# Altium schematic sheet POV_LED_SOLID.SchDoc
size A2
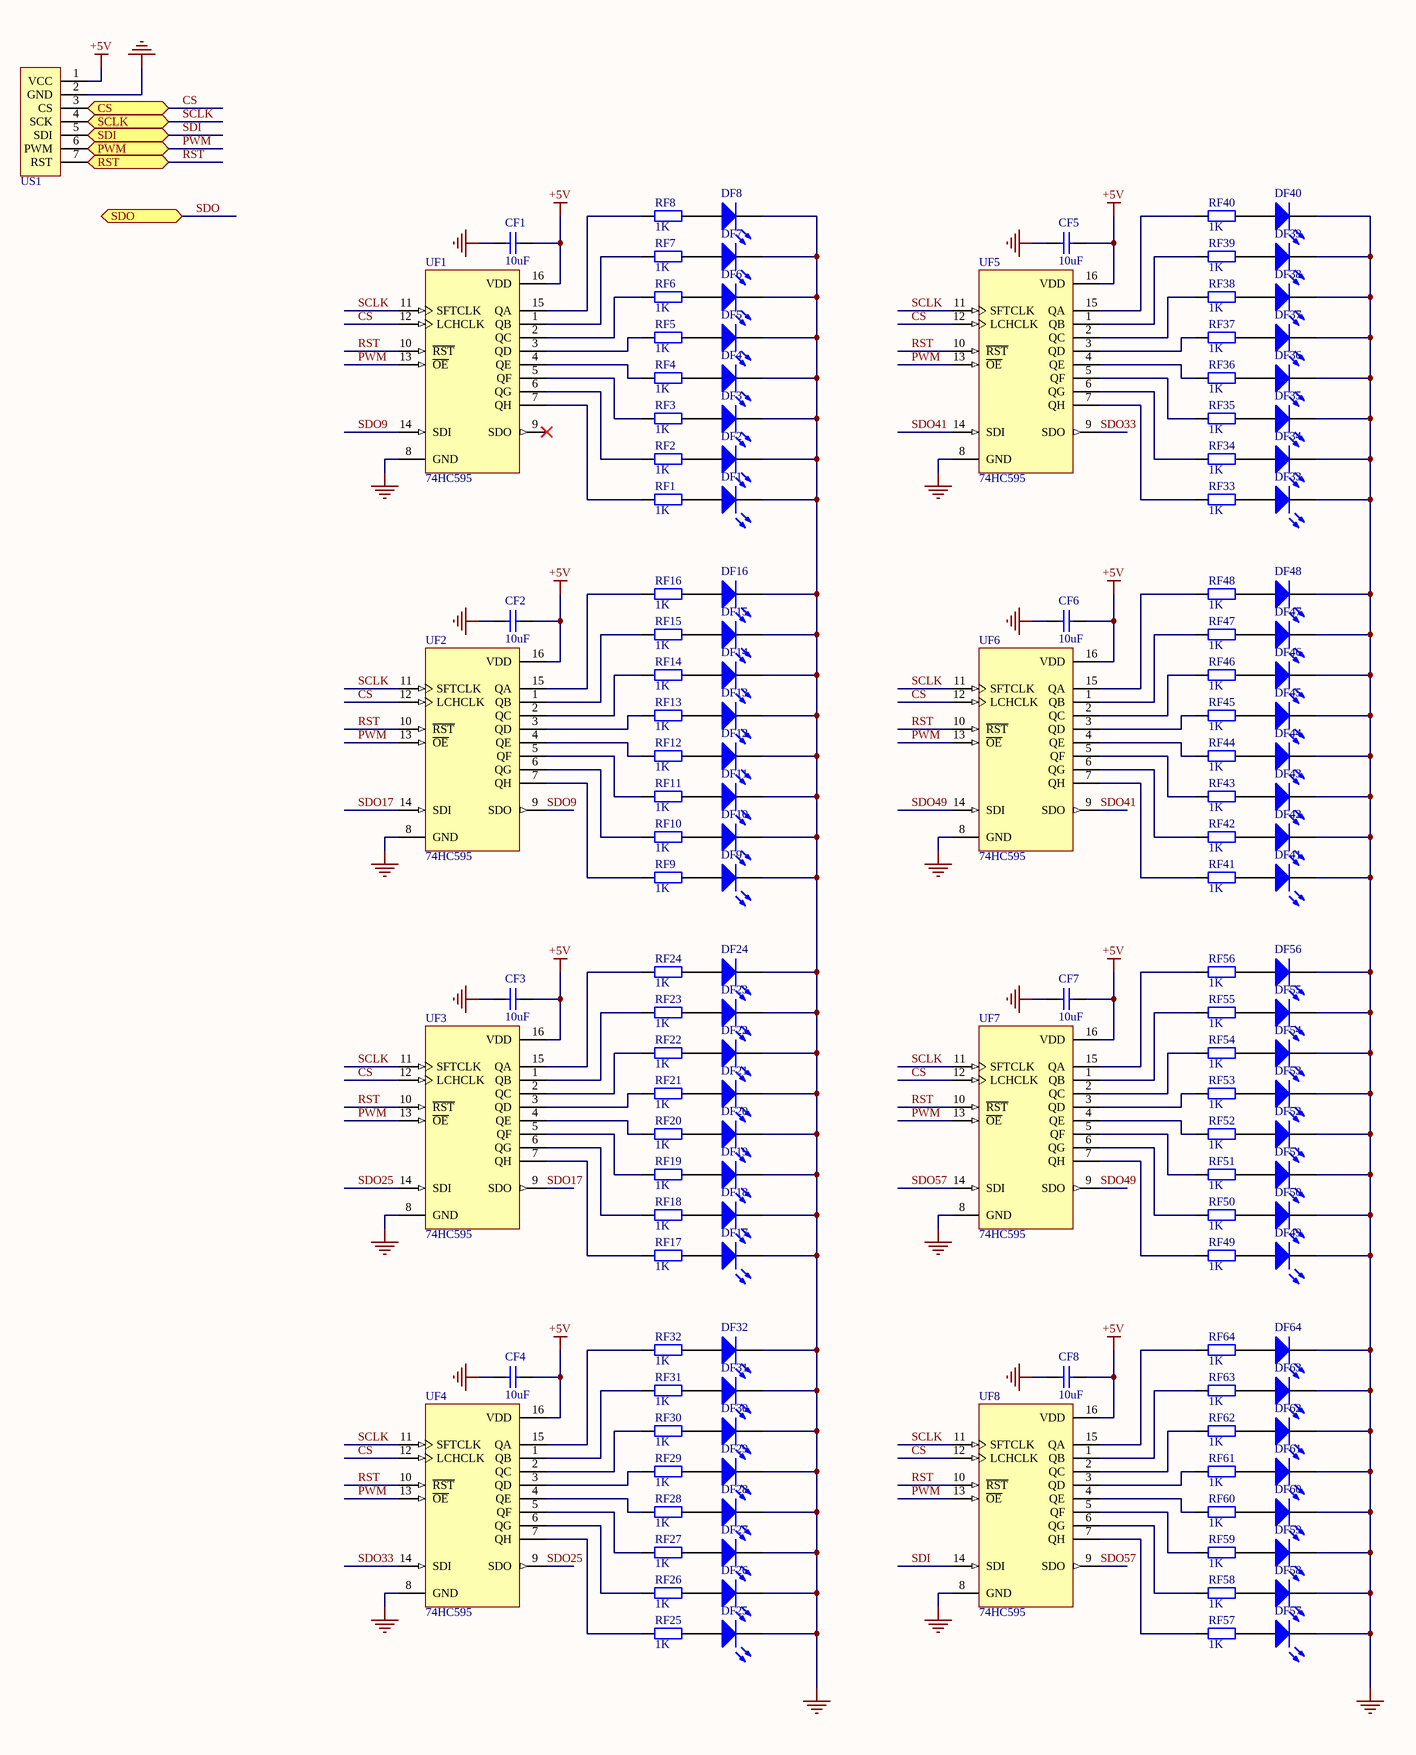
[diagram p0: POV_LED_SOLID.SchDoc]

## Parts
CF1  value 10uF  [CAPC1608N]  (hidden comment: Cap1)
CF2  value 10uF  [CAPC1608N]  (hidden comment: Cap1)
CF3  value 10uF  [CAPC1608N]  (hidden comment: Cap1)
CF4  value 10uF  [CAPC1608N]  (hidden comment: Cap1)
CF5  value 10uF  [CAPC1608N]  (hidden comment: Cap1)
CF6  value 10uF  [CAPC1608N]  (hidden comment: Cap1)
CF7  value 10uF  [CAPC1608N]  (hidden comment: Cap1)
CF8  value 10uF  [CAPC1608N]  (hidden comment: Cap1)
DF1  (no value)  [CD1005-0402-L]
DF2  (no value)  [CD1005-0402-L]
DF3  (no value)  [CD1005-0402-L]
DF4  (no value)  [CD1005-0402-L]
DF5  (no value)  [CD1005-0402-L]
DF6  (no value)  [CD1005-0402-L]
DF7  (no value)  [CD1005-0402-L]
DF8  (no value)  [CD1005-0402-L]
DF9  (no value)  [CD1005-0402-L]
DF10  (no value)  [CD1005-0402-L]
DF11  (no value)  [CD1005-0402-L]
DF12  (no value)  [CD1005-0402-L]
DF13  (no value)  [CD1005-0402-L]
DF14  (no value)  [CD1005-0402-L]
DF15  (no value)  [CD1005-0402-L]
DF16  (no value)  [CD1005-0402-L]
DF17  (no value)  [CD1005-0402-L]
DF18  (no value)  [CD1005-0402-L]
DF19  (no value)  [CD1005-0402-L]
DF20  (no value)  [CD1005-0402-L]
DF21  (no value)  [CD1005-0402-L]
DF22  (no value)  [CD1005-0402-L]
DF23  (no value)  [CD1005-0402-L]
DF24  (no value)  [CD1005-0402-L]
DF25  (no value)  [CD1005-0402-L]
DF26  (no value)  [CD1005-0402-L]
DF27  (no value)  [CD1005-0402-L]
DF28  (no value)  [CD1005-0402-L]
DF29  (no value)  [CD1005-0402-L]
DF30  (no value)  [CD1005-0402-L]
DF31  (no value)  [CD1005-0402-L]
DF32  (no value)  [CD1005-0402-L]
DF33  (no value)  [CD1005-0402-L]
DF34  (no value)  [CD1005-0402-L]
DF35  (no value)  [CD1005-0402-L]
DF36  (no value)  [CD1005-0402-L]
DF37  (no value)  [CD1005-0402-L]
DF38  (no value)  [CD1005-0402-L]
DF39  (no value)  [CD1005-0402-L]
DF40  (no value)  [CD1005-0402-L]
DF41  (no value)  [CD1005-0402-L]
DF42  (no value)  [CD1005-0402-L]
DF43  (no value)  [CD1005-0402-L]
DF44  (no value)  [CD1005-0402-L]
DF45  (no value)  [CD1005-0402-L]
DF46  (no value)  [CD1005-0402-L]
DF47  (no value)  [CD1005-0402-L]
DF48  (no value)  [CD1005-0402-L]
DF49  (no value)  [CD1005-0402-L]
DF50  (no value)  [CD1005-0402-L]
DF51  (no value)  [CD1005-0402-L]
DF52  (no value)  [CD1005-0402-L]
DF53  (no value)  [CD1005-0402-L]
DF54  (no value)  [CD1005-0402-L]
DF55  (no value)  [CD1005-0402-L]
DF56  (no value)  [CD1005-0402-L]
DF57  (no value)  [CD1005-0402-L]
DF58  (no value)  [CD1005-0402-L]
DF59  (no value)  [CD1005-0402-L]
DF60  (no value)  [CD1005-0402-L]
DF61  (no value)  [CD1005-0402-L]
DF62  (no value)  [CD1005-0402-L]
DF63  (no value)  [CD1005-0402-L]
DF64  (no value)  [CD1005-0402-L]
RF1  value 1K  [RESC1005L-0.5]  (hidden comment: Res1)
RF2  value 1K  [RESC1005L-0.5]  (hidden comment: Res1)
RF3  value 1K  [RESC1005L-0.5]  (hidden comment: Res1)
RF4  value 1K  [RESC1005L-0.5]  (hidden comment: Res1)
RF5  value 1K  [RESC1005L-0.5]  (hidden comment: Res1)
RF6  value 1K  [RESC1005L-0.5]  (hidden comment: Res1)
RF7  value 1K  [RESC1005L-0.5]  (hidden comment: Res1)
RF8  value 1K  [RESC1005L-0.5]  (hidden comment: Res1)
RF9  value 1K  [RESC1005L-0.5]  (hidden comment: Res1)
RF10  value 1K  [RESC1005L-0.5]  (hidden comment: Res1)
RF11  value 1K  [RESC1005L-0.5]  (hidden comment: Res1)
RF12  value 1K  [RESC1005L-0.5]  (hidden comment: Res1)
RF13  value 1K  [RESC1005L-0.5]  (hidden comment: Res1)
RF14  value 1K  [RESC1005L-0.5]  (hidden comment: Res1)
RF15  value 1K  [RESC1005L-0.5]  (hidden comment: Res1)
RF16  value 1K  [RESC1005L-0.5]  (hidden comment: Res1)
RF17  value 1K  [RESC1005L-0.5]  (hidden comment: Res1)
RF18  value 1K  [RESC1005L-0.5]  (hidden comment: Res1)
RF19  value 1K  [RESC1005L-0.5]  (hidden comment: Res1)
RF20  value 1K  [RESC1005L-0.5]  (hidden comment: Res1)
RF21  value 1K  [RESC1005L-0.5]  (hidden comment: Res1)
RF22  value 1K  [RESC1005L-0.5]  (hidden comment: Res1)
RF23  value 1K  [RESC1005L-0.5]  (hidden comment: Res1)
RF24  value 1K  [RESC1005L-0.5]  (hidden comment: Res1)
RF25  value 1K  [RESC1005L-0.5]  (hidden comment: Res1)
RF26  value 1K  [RESC1005L-0.5]  (hidden comment: Res1)
RF27  value 1K  [RESC1005L-0.5]  (hidden comment: Res1)
RF28  value 1K  [RESC1005L-0.5]  (hidden comment: Res1)
RF29  value 1K  [RESC1005L-0.5]  (hidden comment: Res1)
RF30  value 1K  [RESC1005L-0.5]  (hidden comment: Res1)
RF31  value 1K  [RESC1005L-0.5]  (hidden comment: Res1)
RF32  value 1K  [RESC1005L-0.5]  (hidden comment: Res1)
RF33  value 1K  [RESC1005L-0.5]  (hidden comment: Res1)
RF34  value 1K  [RESC1005L-0.5]  (hidden comment: Res1)
RF35  value 1K  [RESC1005L-0.5]  (hidden comment: Res1)
RF36  value 1K  [RESC1005L-0.5]  (hidden comment: Res1)
RF37  value 1K  [RESC1005L-0.5]  (hidden comment: Res1)
RF38  value 1K  [RESC1005L-0.5]  (hidden comment: Res1)
RF39  value 1K  [RESC1005L-0.5]  (hidden comment: Res1)
RF40  value 1K  [RESC1005L-0.5]  (hidden comment: Res1)
RF41  value 1K  [RESC1005L-0.5]  (hidden comment: Res1)
RF42  value 1K  [RESC1005L-0.5]  (hidden comment: Res1)
RF43  value 1K  [RESC1005L-0.5]  (hidden comment: Res1)
RF44  value 1K  [RESC1005L-0.5]  (hidden comment: Res1)
RF45  value 1K  [RESC1005L-0.5]  (hidden comment: Res1)
RF46  value 1K  [RESC1005L-0.5]  (hidden comment: Res1)
RF47  value 1K  [RESC1005L-0.5]  (hidden comment: Res1)
RF48  value 1K  [RESC1005L-0.5]  (hidden comment: Res1)
RF49  value 1K  [RESC1005L-0.5]  (hidden comment: Res1)
RF50  value 1K  [RESC1005L-0.5]  (hidden comment: Res1)
RF51  value 1K  [RESC1005L-0.5]  (hidden comment: Res1)
RF52  value 1K  [RESC1005L-0.5]  (hidden comment: Res1)
RF53  value 1K  [RESC1005L-0.5]  (hidden comment: Res1)
RF54  value 1K  [RESC1005L-0.5]  (hidden comment: Res1)
RF55  value 1K  [RESC1005L-0.5]  (hidden comment: Res1)
RF56  value 1K  [RESC1005L-0.5]  (hidden comment: Res1)
RF57  value 1K  [RESC1005L-0.5]  (hidden comment: Res1)
RF58  value 1K  [RESC1005L-0.5]  (hidden comment: Res1)
RF59  value 1K  [RESC1005L-0.5]  (hidden comment: Res1)
RF60  value 1K  [RESC1005L-0.5]  (hidden comment: Res1)
RF61  value 1K  [RESC1005L-0.5]  (hidden comment: Res1)
RF62  value 1K  [RESC1005L-0.5]  (hidden comment: Res1)
RF63  value 1K  [RESC1005L-0.5]  (hidden comment: Res1)
RF64  value 1K  [RESC1005L-0.5]  (hidden comment: Res1)
UF1  74HC595  [TSSOP-16N]
UF2  74HC595  [TSSOP-16N]
UF3  74HC595  [TSSOP-16N]
UF4  74HC595  [TSSOP-16N]
UF5  74HC595  [TSSOP-16N]
UF6  74HC595  [TSSOP-16N]
UF7  74HC595  [TSSOP-16N]
UF8  74HC595  [TSSOP-16N]
US1  SOLID_LED2  [SOLID_LED2]  (value not drawn)

## Ports
CS, PWM, RST, SCLK, SDI, SDO

## Nets
+5V: CF1.2 CF2.2 CF3.2 CF4.2 CF5.2 CF6.2 CF7.2 CF8.2 UF1.16(VDD) UF2.16(VDD) UF3.16(VDD) UF4.16(VDD) UF5.16(VDD) UF6.16(VDD) UF7.16(VDD) UF8.16(VDD) US1.1(VCC)
GND: CF1.1 CF2.1 CF3.1 CF4.1 CF5.1 CF6.1 CF7.1 CF8.1 DF1.2(K) DF2.2(K) DF3.2(K) DF4.2(K) DF5.2(K) DF6.2(K) DF7.2(K) DF8.2(K) DF9.2(K) DF10.2(K) DF11.2(K) DF12.2(K) DF13.2(K) DF14.2(K) DF15.2(K) DF16.2(K) DF17.2(K) DF18.2(K) DF19.2(K) DF20.2(K) DF21.2(K) DF22.2(K) DF23.2(K) DF24.2(K) DF25.2(K) DF26.2(K) DF27.2(K) DF28.2(K) DF29.2(K) DF30.2(K) DF31.2(K) DF32.2(K) DF33.2(K) DF34.2(K) DF35.2(K) DF36.2(K) DF37.2(K) DF38.2(K) DF39.2(K) DF40.2(K) DF41.2(K) DF42.2(K) DF43.2(K) DF44.2(K) DF45.2(K) DF46.2(K) DF47.2(K) DF48.2(K) DF49.2(K) DF50.2(K) DF51.2(K) DF52.2(K) DF53.2(K) DF54.2(K) DF55.2(K) DF56.2(K) DF57.2(K) DF58.2(K) DF59.2(K) DF60.2(K) DF61.2(K) DF62.2(K) DF63.2(K) DF64.2(K) UF1.8(GND) UF2.8(GND) UF3.8(GND) UF4.8(GND) UF5.8(GND) UF6.8(GND) UF7.8(GND) UF8.8(GND) US1.2(GND)
CS: UF1.12(LCHCLK) UF2.12(LCHCLK) UF3.12(LCHCLK) UF4.12(LCHCLK) UF5.12(LCHCLK) UF6.12(LCHCLK) UF7.12(LCHCLK) UF8.12(LCHCLK) US1.3(CS) ; port CS
PWM: UF1.13(~{OE}) UF2.13(~{OE}) UF3.13(~{OE}) UF4.13(~{OE}) UF5.13(~{OE}) UF6.13(~{OE}) UF7.13(~{OE}) UF8.13(~{OE}) US1.6(PWM) ; port PWM
RST: UF1.10(~{RST}) UF2.10(~{RST}) UF3.10(~{RST}) UF4.10(~{RST}) UF5.10(~{RST}) UF6.10(~{RST}) UF7.10(~{RST}) UF8.10(~{RST}) US1.7(RST) ; port RST
SCLK: UF1.11(SFTCLK) UF2.11(SFTCLK) UF3.11(SFTCLK) UF4.11(SFTCLK) UF5.11(SFTCLK) UF6.11(SFTCLK) UF7.11(SFTCLK) UF8.11(SFTCLK) US1.4(SCK) ; port SCLK
SDI: UF8.14(SDI) US1.5(SDI) ; port SDI
SDO: port SDO
SDO9: UF1.14(SDI) UF2.9(SDO)
SDO17: UF2.14(SDI) UF3.9(SDO)
SDO25: UF3.14(SDI) UF4.9(SDO)
SDO33: UF4.14(SDI) UF5.9(SDO)
SDO41: UF5.14(SDI) UF6.9(SDO)
SDO49: UF6.14(SDI) UF7.9(SDO)
SDO57: UF7.14(SDI) UF8.9(SDO)
NetDF1_1: DF1.1(A) RF1.2
NetDF2_1: DF2.1(A) RF2.2
NetDF3_1: DF3.1(A) RF3.2
NetDF4_1: DF4.1(A) RF4.2
NetDF5_1: DF5.1(A) RF5.2
NetDF6_1: DF6.1(A) RF6.2
NetDF7_1: DF7.1(A) RF7.2
NetDF8_1: DF8.1(A) RF8.2
NetDF9_1: DF9.1(A) RF9.2
NetDF10_1: DF10.1(A) RF10.2
NetDF11_1: DF11.1(A) RF11.2
NetDF12_1: DF12.1(A) RF12.2
NetDF13_1: DF13.1(A) RF13.2
NetDF14_1: DF14.1(A) RF14.2
NetDF15_1: DF15.1(A) RF15.2
NetDF16_1: DF16.1(A) RF16.2
NetDF17_1: DF17.1(A) RF17.2
NetDF18_1: DF18.1(A) RF18.2
NetDF19_1: DF19.1(A) RF19.2
NetDF20_1: DF20.1(A) RF20.2
NetDF21_1: DF21.1(A) RF21.2
NetDF22_1: DF22.1(A) RF22.2
NetDF23_1: DF23.1(A) RF23.2
NetDF24_1: DF24.1(A) RF24.2
NetDF25_1: DF25.1(A) RF25.2
NetDF26_1: DF26.1(A) RF26.2
NetDF27_1: DF27.1(A) RF27.2
NetDF28_1: DF28.1(A) RF28.2
NetDF29_1: DF29.1(A) RF29.2
NetDF30_1: DF30.1(A) RF30.2
NetDF31_1: DF31.1(A) RF31.2
NetDF32_1: DF32.1(A) RF32.2
NetDF33_1: DF33.1(A) RF33.2
NetDF34_1: DF34.1(A) RF34.2
NetDF35_1: DF35.1(A) RF35.2
NetDF36_1: DF36.1(A) RF36.2
NetDF37_1: DF37.1(A) RF37.2
NetDF38_1: DF38.1(A) RF38.2
NetDF39_1: DF39.1(A) RF39.2
NetDF40_1: DF40.1(A) RF40.2
NetDF41_1: DF41.1(A) RF41.2
NetDF42_1: DF42.1(A) RF42.2
NetDF43_1: DF43.1(A) RF43.2
NetDF44_1: DF44.1(A) RF44.2
NetDF45_1: DF45.1(A) RF45.2
NetDF46_1: DF46.1(A) RF46.2
NetDF47_1: DF47.1(A) RF47.2
NetDF48_1: DF48.1(A) RF48.2
NetDF49_1: DF49.1(A) RF49.2
NetDF50_1: DF50.1(A) RF50.2
NetDF51_1: DF51.1(A) RF51.2
NetDF52_1: DF52.1(A) RF52.2
NetDF53_1: DF53.1(A) RF53.2
NetDF54_1: DF54.1(A) RF54.2
NetDF55_1: DF55.1(A) RF55.2
NetDF56_1: DF56.1(A) RF56.2
NetDF57_1: DF57.1(A) RF57.2
NetDF58_1: DF58.1(A) RF58.2
NetDF59_1: DF59.1(A) RF59.2
NetDF60_1: DF60.1(A) RF60.2
NetDF61_1: DF61.1(A) RF61.2
NetDF62_1: DF62.1(A) RF62.2
NetDF63_1: DF63.1(A) RF63.2
NetDF64_1: DF64.1(A) RF64.2
NetRF1_1: RF1.1 UF1.7(QH)
NetRF2_1: RF2.1 UF1.6(QG)
NetRF3_1: RF3.1 UF1.5(QF)
NetRF4_1: RF4.1 UF1.4(QE)
NetRF5_1: RF5.1 UF1.3(QD)
NetRF6_1: RF6.1 UF1.2(QC)
NetRF7_1: RF7.1 UF1.1(QB)
NetRF8_1: RF8.1 UF1.15(QA)
NetRF9_1: RF9.1 UF2.7(QH)
NetRF10_1: RF10.1 UF2.6(QG)
NetRF11_1: RF11.1 UF2.5(QF)
NetRF12_1: RF12.1 UF2.4(QE)
NetRF13_1: RF13.1 UF2.3(QD)
NetRF14_1: RF14.1 UF2.2(QC)
NetRF15_1: RF15.1 UF2.1(QB)
NetRF16_1: RF16.1 UF2.15(QA)
NetRF17_1: RF17.1 UF3.7(QH)
NetRF18_1: RF18.1 UF3.6(QG)
NetRF19_1: RF19.1 UF3.5(QF)
NetRF20_1: RF20.1 UF3.4(QE)
NetRF21_1: RF21.1 UF3.3(QD)
NetRF22_1: RF22.1 UF3.2(QC)
NetRF23_1: RF23.1 UF3.1(QB)
NetRF24_1: RF24.1 UF3.15(QA)
NetRF25_1: RF25.1 UF4.7(QH)
NetRF26_1: RF26.1 UF4.6(QG)
NetRF27_1: RF27.1 UF4.5(QF)
NetRF28_1: RF28.1 UF4.4(QE)
NetRF29_1: RF29.1 UF4.3(QD)
NetRF30_1: RF30.1 UF4.2(QC)
NetRF31_1: RF31.1 UF4.1(QB)
NetRF32_1: RF32.1 UF4.15(QA)
NetRF33_1: RF33.1 UF5.7(QH)
NetRF34_1: RF34.1 UF5.6(QG)
NetRF35_1: RF35.1 UF5.5(QF)
NetRF36_1: RF36.1 UF5.4(QE)
NetRF37_1: RF37.1 UF5.3(QD)
NetRF38_1: RF38.1 UF5.2(QC)
NetRF39_1: RF39.1 UF5.1(QB)
NetRF40_1: RF40.1 UF5.15(QA)
NetRF41_1: RF41.1 UF6.7(QH)
NetRF42_1: RF42.1 UF6.6(QG)
NetRF43_1: RF43.1 UF6.5(QF)
NetRF44_1: RF44.1 UF6.4(QE)
NetRF45_1: RF45.1 UF6.3(QD)
NetRF46_1: RF46.1 UF6.2(QC)
NetRF47_1: RF47.1 UF6.1(QB)
NetRF48_1: RF48.1 UF6.15(QA)
NetRF49_1: RF49.1 UF7.7(QH)
NetRF50_1: RF50.1 UF7.6(QG)
NetRF51_1: RF51.1 UF7.5(QF)
NetRF52_1: RF52.1 UF7.4(QE)
NetRF53_1: RF53.1 UF7.3(QD)
NetRF54_1: RF54.1 UF7.2(QC)
NetRF55_1: RF55.1 UF7.1(QB)
NetRF56_1: RF56.1 UF7.15(QA)
NetRF57_1: RF57.1 UF8.7(QH)
NetRF58_1: RF58.1 UF8.6(QG)
NetRF59_1: RF59.1 UF8.5(QF)
NetRF60_1: RF60.1 UF8.4(QE)
NetRF61_1: RF61.1 UF8.3(QD)
NetRF62_1: RF62.1 UF8.2(QC)
NetRF63_1: RF63.1 UF8.1(QB)
NetRF64_1: RF64.1 UF8.15(QA)

Not connected (* = marked no-connect by the designer): UF1 9(SDO)*

## Library data of the parts
CF1-CF8 = Cap1: Capacitor; Published: 8-Jun-2000; LatestRevisionDate: 17-Jul-2002; LatestRevisionNote: Re-released for DXP Platform.; PackageReference: RAD-0.3; Publisher: Altium Limited
DF1-DF64 = LED2: Typical RED, GREEN, YELLOW, AMBER GaAs LED; Published: 8-Jun-2000; LatestRevisionDate: 17-Jul-2002; LatestRevisionNote: Re-released for DXP Platform.; PackageVersion: Feb-2002; PackageReference: 3.2X1.6X1.1; Publisher: Altium Limited; PackageDescription: SM LED; 2 Flat Leads
RF1-RF64 = Res1: Resistor; Published: 8-Jun-2000; LatestRevisionDate: 17-Jul-2002; LatestRevisionNote: Re-released for DXP Platform.; PackageReference: AXIAL-0.4; Publisher: Altium Limited
UF1-UF8 = 74HC595: 8-Bit Serial-Input/Serial or Prallel-Output Shift Register with Latched 3-State Outputs; Published: 15-Apr-2002; LatestRevisionDate: 12-Dec-2006; LatestRevisionNote: IPC-7351 Footprint Added.; DatasheetVersion: Mar-2000; PackageVersion: Feb-2000; PackageReference: 948F-01; Publisher: Altium Limited; PackageDescription: 16-Pin Thin Small Outline Package 0.65 mm Pitch; ComponentLink1Description: Manufacturer Link; ComponentLink1URL: http://www.onsemi.com/; ComponentLink2Description: Datasheet; ComponentLink2URL: http://www.onsemi.com/pub/Collateral/MC74HC595A-D.PDF